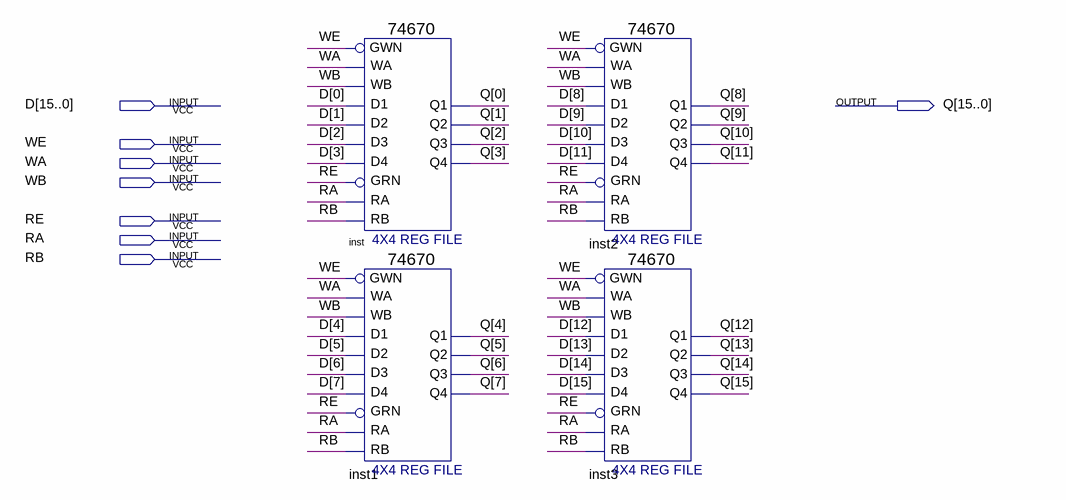
[diagram p0: schematic sheet]
// Quartus schematic REG_R.bdf as structural Verilog: 4 symbols, 8 pins
module REG_R (
  input  [15:0] D,
  input  WE,
  input  WA,
  input  WB,
  input  RE,
  input  RA,
  input  RB,
  output [15:0] Q
);

  \74670  inst (
    .WA(WA), .D1(D[0]), .WB(WB), .D2(D[1]), .GRN(RE), .D4(D[3]), .D3(D[2]), .RA(RA), .RB(RB), .GWN(WE),
    .Q3(Q[2]), .Q4(Q[3]), .Q1(Q[0]), .Q2(Q[1]));
  \74670  inst1 (
    .WA(WA), .D1(D[4]), .WB(WB), .D2(D[5]), .GRN(RE), .D4(D[7]), .D3(D[6]), .RA(RA), .RB(RB), .GWN(WE),
    .Q3(Q[6]), .Q4(Q[7]), .Q1(Q[4]), .Q2(Q[5]));
  \74670  inst2 (
    .WA(WA), .D1(D[8]), .WB(WB), .D2(D[9]), .GRN(RE), .D4(D[11]), .D3(D[10]), .RA(RA), .RB(RB), .GWN(WE),
    .Q3(Q[10]), .Q4(Q[11]), .Q1(Q[8]), .Q2(Q[9]));
  \74670  inst3 (
    .WA(WA), .D1(D[12]), .WB(WB), .D2(D[13]), .GRN(RE), .D4(D[15]), .D3(D[14]), .RA(RA), .RB(RB), .GWN(WE),
    .Q3(Q[14]), .Q4(Q[15]), .Q1(Q[12]), .Q2(Q[13]));
endmodule
